# EAGLE schematic domus-silicea-board01-schematic (EAGLE 7.3.0)
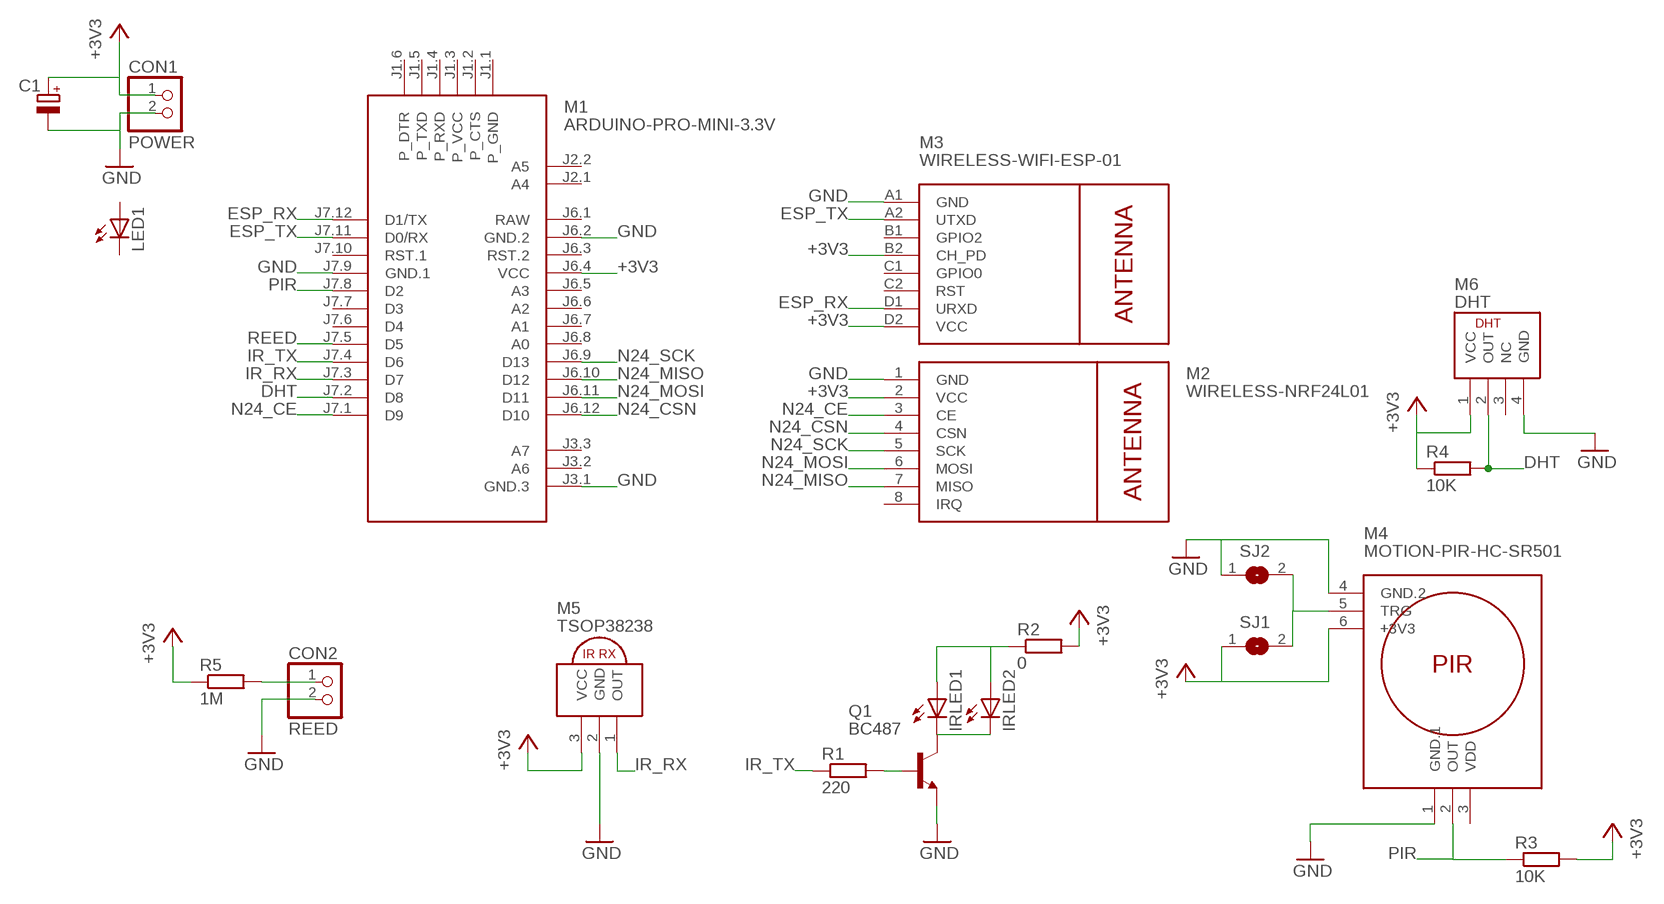
[diagram p0: schematic, sheet 1]

## Parts
C1  CPOL-EUE2,5-6E  [E2,5-6E]
CON1  POWER  PINHD-1X2  [1X02]
CON2  REED  PINHD-1X2  [1X02]
IRLED1  LED5MM  [LED5MM]
IRLED2  LED5MM  [LED5MM]
LED1  LED5MM  [LED5MM]
M1  ARDUINO-PRO-MINI-3.3V  [ARDUINO-PRO-MINI]
M2  WIRELESS-NRF24L01  [WIRELESS-NRF24L01]
M3  WIRELESS-WIFI-ESP-01  [WIRELESS-WIFI-ESP-01]
M4  MOTION-PIR-HC-SR501  [MOTION-PIR-HC-SR501]
M5  TSOP38238  [TSOP38238]
M6  DHT  [DHT]
Q1  BC487  [TO92-EBC]
R1  220  R-EU_0207/10  [0207/10]
R2  0  R-EU_0207/10  [0207/10]
R3  10K  R-EU_0207/10  [0207/10]
R4  10K  R-EU_0207/10  [0207/10]
R5  1M  R-EU_0207/10  [0207/10]
SJ1  SJ  [SJ]
SJ2  SJ  [SJ]

## Nets
+3V3: C1.+ CON1.1 M1.J6.4(VCC) M2.2(VCC) M3.B2(CH_PD) M3.D2(VCC) M4.6(+3V3) M5.3(VCC) M6.1(VCC) R2.2 R3.2 R4.1 R5.1 SJ1.1
DHT: M1.J7.2(D8) M6.2(OUT) R4.2
ESP_RX: M1.J7.12(D1/TX) M3.D1(URXD)
ESP_TX: M1.J7.11(D0/RX) M3.A2(UTXD)
GND: C1.- CON1.2 CON2.2 M1.J3.1(GND.3) M1.J6.2(GND.2) M1.J7.9(GND.1) M2.1(GND) M3.A1(GND) M4.1(GND.1) M4.4(GND.2) M5.2(GND) M6.4(GND) Q1.E SJ2.1
IR_RX: M1.J7.3(D7) M5.1(OUT)
IR_TX: M1.J7.4(D6) R1.1
N24_CE: M1.J7.1(D9) M2.3(CE)
N24_CSN: M1.J6.12(D10) M2.4(CSN)
N24_MISO: M1.J6.10(D12) M2.7(MISO)
N24_MOSI: M1.J6.11(D11) M2.6(MOSI)
N24_SCK: M1.J6.9(D13) M2.5(SCK)
N$1: IRLED1.K(C) IRLED2.K(C) Q1.C
N$2: IRLED1.A IRLED2.A R2.1
N$3: Q1.B R1.2
N$4: CON2.1 R5.2
N$5: M4.5(TRG) SJ1.2 SJ2.2
PIR: M1.J7.8(D2) M4.2(OUT) R3.1
REED: M1.J7.5(D5)
Unconnected: LED1.A LED1.K(C) M1.J1.1(P_GND) M1.J1.2(P_CTS) M1.J1.3(P_VCC) M1.J1.4(P_RXD) M1.J1.5(P_TXD) M1.J1.6(P_DTR) M1.J2.1(A4) M1.J2.2(A5) M1.J3.2(A6) M1.J3.3(A7) M1.J6.3(RST.2) M1.J6.5(A3) M1.J6.6(A2) M1.J6.7(A1) M1.J6.8(A0) M1.J7.6(D4) M1.J7.7(D3) M1.J7.10(RST.1) M2.8(IRQ) M3.B1(GPIO2) M3.C1(GPIO0) M3.C2(RST) M6.3(NC)

## Power pins joined to a net without a drawn wire
RAW: M1.J6.1(RAW)
VDD: M4.3(VDD)

## Library data of the parts
C1 = rcl:CPOL-EU: POLARIZED CAPACITOR, European symbol
CON1 CON2 = pinhead:PINHD-1X2: PIN HEADER
IRLED1 IRLED2 LED1 = led:LED: LED OSRAM: - CHIPLED LG R971, LG N971, LY N971, LG Q971, LY Q971, LO R971, LY R971 LH N974, LH R974 LS Q976, LO Q976, LY Q976 LO Q996 - Hyper CHIPLED LW Q18S LB Q993, LB Q99A, LB R99A - SideLED LS A670, LO A670, LY A670, LG A670, LP A670 LB A673, LV A673, LT A673, LW A673 LH A674 LY A675 LS A676, LA A676, LO A676, LY A676, LW A676 LS A679, LY A679, LG A679 - Hyper Micro SIDELED® LS Y876, LA Y876, LO Y876, LY Y876 LT Y87S - SmartLED LW L88C, LW L88S LB L89C, LB L89S, LG L890 LS L89K, LO L89K, LY L89K LS L896, LA L896, LO L896, LY L896 - TOPLED LS T670, LO T670, LY T670, LG T670, LP T670 LSG T670, LSP T670, LSY T670, LOP T670, LYG T670 LG T671, LOG T671, LSG T671 LB T673, LV T673, LT T673, LW T673 LH T674 LS T676, LA T676, LO T676, LY T676, LB T676, LH T676, LSB T676, LW T676 LB T67C, LV T67C, LT T67C, LS T67K, LO T67K, LY T67K, LW E67C LS E67B, LA E67B, LO E67B, LY E67B, LB E67C, LV E67C, LT E67C LW T67C LS T679, LY T679, LG T679 LS T770, LO T770, LY T770, LG T770, LP T770 LB T773, LV T773, LT T773, LW T773 LH T774 LS E675, LA E675, LY E675, LS T675 LS T776, LA T776, LO T776, LY T776, LB T776 LHGB T686 LT T68C, LB T68C - Hyper Mini TOPLED® LB M676 - Mini TOPLED Santana® LG M470 LS M47K, LO M47K, LY M47K Source: http://www.osram.convergy.de LUXEON: - LUMILED® LXK2-PW12-R00, LXK2-PW12-S00, LXK2-PW14-U00, LXK2-PW14-V00 LXK2-PM12-R00, LXK2-PM12-S00, LXK2-PM14-U00 LXK2-PE12-Q00, LXK2-PE12-R00, LXK2-PE12-S00, LXK2-PE14-T00, LXK2-PE14-U00 LXK2-PB12-K00, LXK2-PB12-L00, LXK2-PB12-M00, LXK2-PB14-N00, LXK2-PB14-P00, LXK2-PB14-Q00 LXK2-PR12-L00, LXK2-PR12-M00, LXK2-PR14-Q00, LXK2-PR14-R00 LXK2-PD12-Q00, LXK2-PD12-R00, LXK2-PD12-S00 LXK2-PH12-R00, LXK2-PH12-S00 LXK2-PL12-P00, LXK2-PL12-Q00, LXK2-PL12-R00 Source: www.luxeon.com KINGBRIGHT: KA-3528ASYC Source: www.kingbright.com
M1 = diy-modules:ARDUINO-PRO-MINI-*: Arduino Pro Mini
M2 = diy-modules:WIRELESS-NRF24L01: 2.4 GHz Wireless Module based on NRF24L01 chip
M3 = diy-modules:WIRELESS-WIFI-ESP-01: Wireless Wi-Fi ESP-01 Module based on ESP8266 chip
M4 = domus-silicea:MOTION-PIR-HC-SR501: PIR Motion Sensor Module HC-SR501 with low power pyroelectic detector
M5 = domus-silicea:TSOP38238: TSOP38238 IR Receiver
M6 = domus-silicea:DHT: DHT11/DHT12 Humidity and Temperature sensor
Q1 = transistor-npn:BC487*: NPN Transistor
R1-R5 = resistor:R-EU_: RESISTOR, European symbol
SJ1 SJ2 = jumper:SJ: SMD solder JUMPER